# Altium schematic sheet panel_power_backlight.SchDoc
size A4
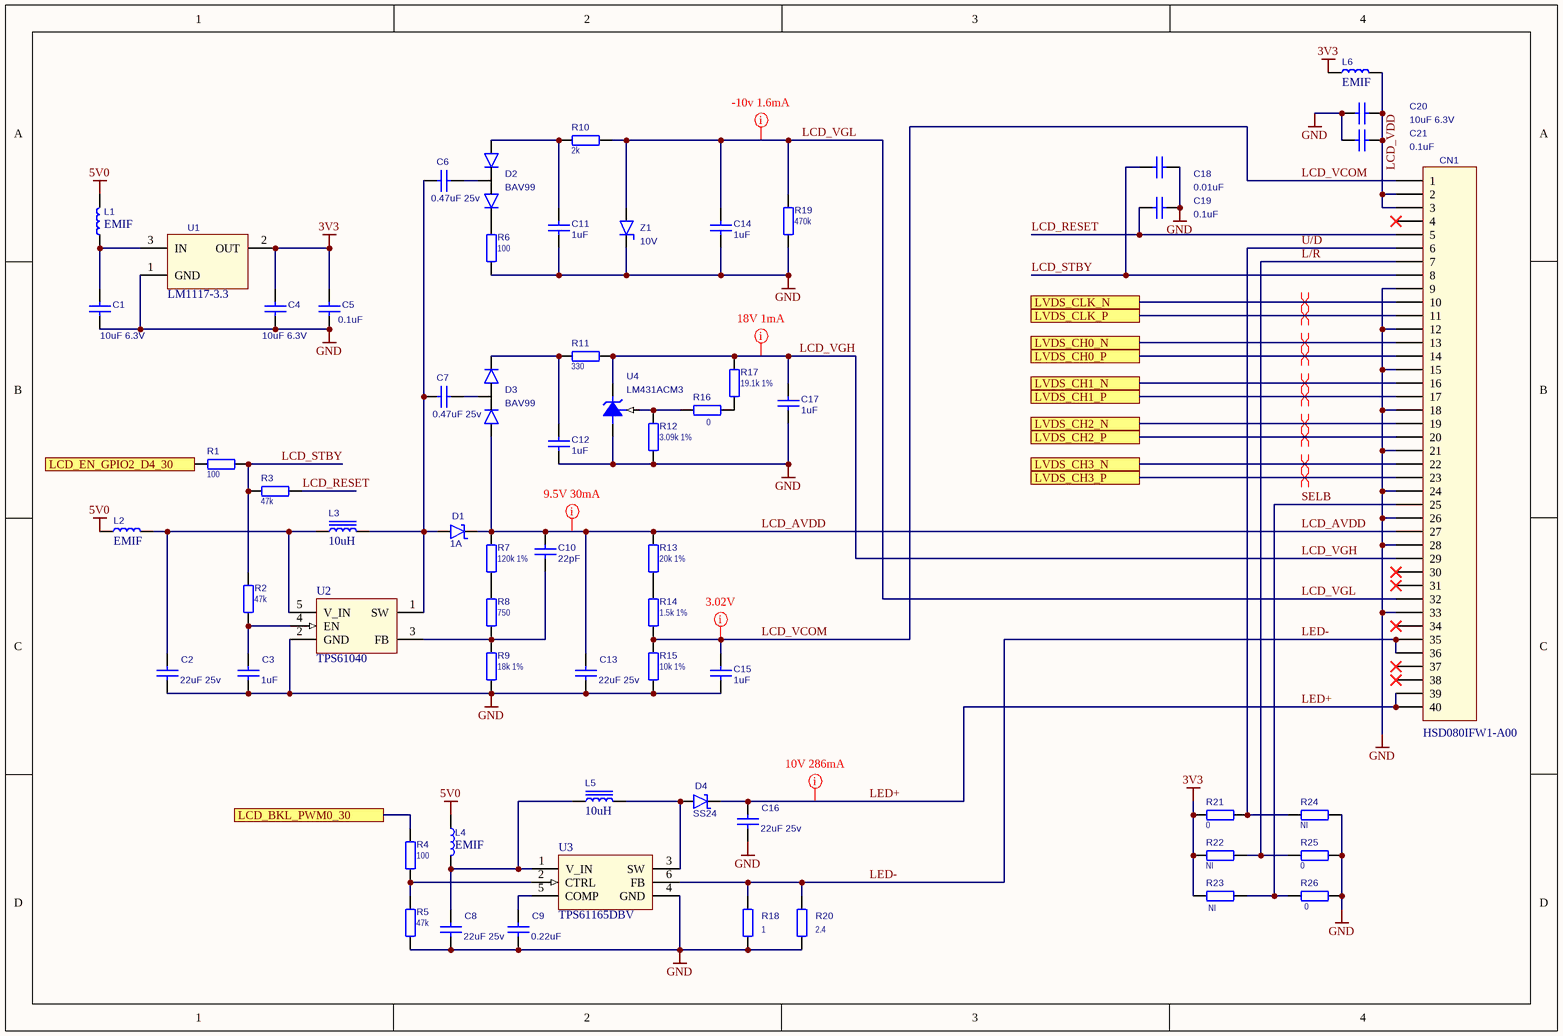
[diagram p0: panel_power_backlight.SchDoc]

## Parts
C1  value 10uF 6.3V  [C0603]  (hidden comment: CC0603MRX5R5BB106)
C2  value 22uF 25v  [C0805]  (hidden comment: CL21A226MAQNNNE)
C3  value 1uF  [C0603]  (hidden comment: CC0603KRX7R9BB105)
C4  value 10uF 6.3V  [C0603]  (hidden comment: CC0603MRX5R5BB106)
C5  value 0.1uF  [C0603]  (hidden comment: C1608X7R1H104K080AA)
C6  value 0.47uF 25v  [C0603]  (hidden comment: GRM188R71E474KA12D)
C7  value 0.47uF 25v  [C0603]  (hidden comment: GRM188R71E474KA12D)
C8  value 22uF 25v  [C0805]  (hidden comment: CL21A226MAQNNNE)
C9  value 0.22uF  [C0603]  (hidden comment: CC0603ZRY5V8BB224)
C10  value 22pF  [C0603]  (hidden comment: CL10C220JB8NNNC)
C11  value 1uF  [C0603]  (hidden comment: CC0603KRX7R9BB105)
C12  value 1uF  [C0603]  (hidden comment: CC0603KRX7R9BB105)
C13  value 22uF 25v  [C0805]  (hidden comment: CL21A226MAQNNNE)
C14  value 1uF  [C0603]  (hidden comment: CC0603KRX7R9BB105)
C15  value 1uF  [C0603]  (hidden comment: CC0603KRX7R9BB105)
C16  value 22uF 25v  [C0805]  (hidden comment: CL21A226MAQNNNE)
C17  value 1uF  [C0603]  (hidden comment: CC0603KRX7R9BB105)
C18  value 0.01uF  [C0603]  (hidden comment: CL10B103KB8NNNC)
C19  value 0.1uF  [C0603]  (hidden comment: C1608X7R1H104K080AA)
C20  value 10uF 6.3V  [C0603]  (hidden comment: CC0603MRX5R5BB106)
C21  value 0.1uF  [C0603]  (hidden comment: C1608X7R1H104K080AA)
CN1  value HSD080IFW1-A00  [40S-0.5SH]  (hidden comment: FH12-40)
D1  value 1A  [SOD-323]  (hidden comment: PMEG2010EJ.115)
D2  value BAV99  [SOT-23-3]  (hidden comment: BAV99.215)
D3  value BAV99  [SOT-23-3]  (hidden comment: BAV99.215)
D4  SS24  [SMA]
L1  value EMIF  [IND0805]  (hidden comment: BLM21PG221SN1D)
L2  value EMIF  [IND0805]  (hidden comment: BLM21PG221SN1D)
L3  value 10uH  [CDRH3D16]  (hidden comment: CDRH3D16NP-100NC)
L4  value EMIF  [IND0805]  (hidden comment: BLM21PG221SN1D)
L5  value 10uH  [CDRH6D28]  (hidden comment: CDRH6D28-100NC)
L6  value EMIF  [IND0805]  (hidden comment: BLM21PG221SN1D)
R1  100  [R0603]
R2  47k  [R0603]
R3  47k  [R0603]
R4  100  [R0603]
R5  47k  [R0603]
R6  100  [R0603]
R7  value 120k 1%  [R0603]  (hidden comment: 120k)
R8  750  [R0603]
R9  value 18k 1%  [R0603]  (hidden comment: 18k)
R10  2k  [R0603]
R11  330  [R0603]
R12  value 3.09k 1%  [R0603]  (hidden comment: 3.09k)
R13  value 20k 1%  [R0603]  (hidden comment: RC0603FR-0720KL)
R14  value 1.5k 1%  [R0603]  (hidden comment: RC0603FR-071K5L)
R15  value 10k 1%  [R0603]  (hidden comment: RC0603FR-0710KL)
R16  0  [R0603]
R17  19.1k 1%  [R0603]
R18  value 1  [R0805]  (hidden comment: RC0805FR-071RL)
R19  470k  [R0603]
R20  value 2.4  [R0805]  (hidden comment: RES 0805 2R4 5%)
R21  0  [R0603]
R22  value NI  [R0603]  (hidden comment: DNI)
R23  value NI  [R0603]  (hidden comment: DNI)
R24  value NI  [R0603]  (hidden comment: DNI)
R25  0  [R0603]
R26  0  [R0603]
U1  value LM1117-3.3  [SOT-223]  (hidden comment: LM1117)
U2  TPS61040  [SOT-23-5]
U3  value TPS61165DBV  [SOT-23-6]  (hidden comment: TPS61165)
U4  LM431ACM3  [SOT-23-3]
Z1  value 10V  [SOD-80C]  (hidden comment: BZV55-C10.115)

## Ports
LCD_BKL_PWM0_30, LCD_EN_GPIO2_D4_30, LVDS_CH0_N, LVDS_CH0_P, LVDS_CH1_N, LVDS_CH1_P, LVDS_CH2_N, LVDS_CH2_P, LVDS_CH3_N, LVDS_CH3_P, LVDS_CLK_N, LVDS_CLK_P

## Nets
3V3: C4.1 C5.2 L6.1 R21.1 R22.1 R23.1 U1.2(OUT)
5V0: L1.2 L2.2 L4.2
GND: C1.2 C2.1 C3.1 C4.2 C5.1 C8.1 C9.1 C11.1 C12.1 C13.1 C14.1 C15.1 C16.1 C17.1 C18.1 C19.1 C20.1 C21.2 CN1.9 CN1.12 CN1.15 CN1.18 CN1.21 CN1.24 CN1.26 CN1.28 CN1.33 R5.1 R6.2 R9.1 R12.1 R15.1 R18.1 R19.1 R20.1 R24.2 R25.2 R26.2 U1.1(GND) U2.2(GND) U3.4(GND) U4.3(A) Z1.2(K)
L/R: CN1.7 R22.2 R25.1
LCD_AVDD: C10.1 C13.2 CN1.27 D1.2(K) D3.1(A) R7.2 R13.2
LCD_BKL_PWM0_30: R4.2 ; port LCD_BKL_PWM0_30
LCD_EN_GPIO2_D4_30: R1.2 ; port LCD_EN_GPIO2_D4_30
LCD_RESET: C19.2 CN1.5 R3.1
LCD_STBY: C18.2 CN1.8 R1.1 R2.2 R3.2
LCD_VCOM: C15.2 CN1.1 R14.1 R15.2
LCD_VDD: C20.2 C21.1 CN1.2 CN1.3 L6.2
LCD_VGH: C17.2 CN1.29 R11.2 R17.2 U4.1(K)
LCD_VGL: C14.2 CN1.32 R10.2 R19.2 Z1.1(A)
LED+: C16.2 CN1.39 CN1.40 D4.2(K)
LED-: CN1.35 CN1.36 R18.2 R20.2 U3.6(FB)
LVDS_CH0_N: CN1.13 ; port LVDS_CH0_N
LVDS_CH0_P: CN1.14 ; port LVDS_CH0_P
LVDS_CH1_N: CN1.16 ; port LVDS_CH1_N
LVDS_CH1_P: CN1.17 ; port LVDS_CH1_P
LVDS_CH2_N: CN1.19 ; port LVDS_CH2_N
LVDS_CH2_P: CN1.20 ; port LVDS_CH2_P
LVDS_CH3_N: CN1.22 ; port LVDS_CH3_N
LVDS_CH3_P: CN1.23 ; port LVDS_CH3_P
LVDS_CLK_N: CN1.10 ; port LVDS_CLK_N
LVDS_CLK_P: CN1.11 ; port LVDS_CLK_P
SELB: CN1.25 R23.2 R26.1
U/D: CN1.6 R21.2 R24.1
NetC1_1: C1.1 L1.1 U1.3(IN)
NetC2_2: C2.2 L2.1 L3.1 U2.5(V_IN)
NetC3_2: C3.2 R2.1 U2.4(EN)
NetC6_1: C6.1 D2.3(A+K)
NetC6_2: C6.2 C7.2 D1.1(A) L3.2 U2.1(SW)
NetC7_1: C7.1 D3.3(A+K)
NetC8_2: C8.2 L4.1 L5.1 U3.1(V_IN)
NetC9_2: C9.2 U3.5(COMP)
NetC10_2: C10.2 R8.1 R9.2 U2.3(FB)
NetC11_2: C11.2 D2.1(A) R10.1
NetC12_2: C12.2 D3.2(K) R11.1
NetD2_2: D2.2(K) R6.1
NetD4_1: D4.1(A) L5.2 U3.3(SW)
NetR4_1: R4.1 R5.2 U3.2(CTRL)
NetR7_1: R7.1 R8.2
NetR12_2: R12.2 R16.2 U4.2(REF)
NetR13_1: R13.1 R14.2
NetR16_1: R16.1 R17.1

Not connected (* = marked no-connect by the designer): CN1 4* 30* 31* 34* 37* 38*

## Layout directives
mark named 10V 286mA: LED+
mark named 9.5V 30mA: LCD_AVDD
mark named -10v 1.6mA: LCD_VGL
mark named 18V 1mA: LCD_VGH
mark named 3.02V: LCD_VCOM
differential pair: LVDS_CH0_N, LVDS_CH0_P, LVDS_CH1_N, LVDS_CH1_P, LVDS_CH2_N, LVDS_CH2_P, LVDS_CH3_N, LVDS_CH3_P, LVDS_CLK_N, LVDS_CLK_P

## Library data of the parts
C1-C21 = CAP_NPOL
CN1 = FH12-40: DT38
D1 D4 = SHOTTKY
  D4: Value: SS24
D2 D3 = DIODE_DUAL_1: Dual series 1
L1 L2 L4 L6 = IND_WO_IRON
L3 L5 = IND_W_IRON
R1 R4 = RESISTOR: Value: 100
R2 R3 R5-R26 = RESISTOR: RES
  R2 R3 R5: Value: 47k
  R6: Value: 100
  R8: Value: 750
  R10: Value: 2k
  R11: Value: 330
  R16 R21 R25 R26: Value: 0
  R17: Value: 19.1k 1%
  R19: Value: 470k
U2 = TPS6104x
U3 = TPS61165DBV: TPS61165DBV (SOT-23-6 package)
U4 = LM431ACM3: Adjustable Precision Zener Shunt Regulator, 3-pin SOT-23; Manufacturer: National Semiconductor; PackageTopMarking: N1F*XTT; PowerWise: N; CompType: MiscPower; Published: 4-Dec-2008; DatasheetVersion: Mar-2005; PackageVersion: revB, Mar-2003; PackageReference: MF03A; Publisher: Altium Limited; PackageDescription: Molded SOT-23, .115 x .051 x .037in Body, 3 Lead, .075 in Pitch; Supplier 1: Farnell; Supplier Part Number 1: 1215209; PartNumber: LM431ACM3; RoHS: N; PinCount: 3; ComponentLink1Description: LM431 Datasheet; ComponentLink1URL: http://www.national.com/ds/LM/LM431.pdf; ComponentLink2Description: LM431 Web Page; ComponentLink2URL: http://www.national.com/pf/LM/LM431.html; ComponentLink3Description: MF03A Package Page; ComponentLink3URL: http://www.national.com/packaging/folders/mf03a.html
Z1 = ZENNER